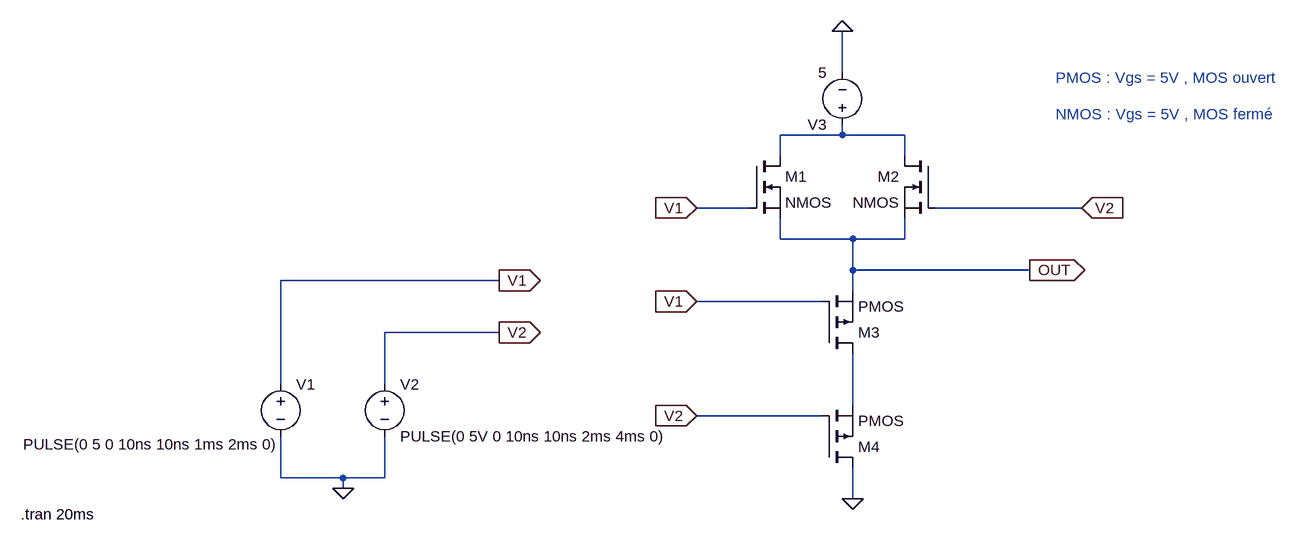
[diagram p0: schematic Draft5.asc]
Draft5.asc, the LTspice schematic file:
Version 4
SHEET 1 940 680
WIRE 256 -384 256 -448
WIRE 256 -288 256 -304
WIRE 256 -288 160 -288
WIRE 352 -288 256 -288
WIRE 160 -256 160 -288
WIRE 352 -256 352 -288
WIRE 112 -176 32 -176
WIRE 624 -176 400 -176
WIRE 160 -128 160 -160
WIRE 272 -128 160 -128
WIRE 352 -128 352 -160
WIRE 352 -128 272 -128
WIRE 272 -80 272 -128
WIRE 544 -80 272 -80
WIRE -272 -64 -608 -64
WIRE 272 -48 272 -80
WIRE 224 -32 32 -32
WIRE -272 16 -448 16
WIRE -608 96 -608 -64
WIRE -448 96 -448 16
WIRE 272 128 272 48
WIRE 224 144 32 144
WIRE -608 240 -608 176
WIRE -512 240 -608 240
WIRE -448 240 -448 176
WIRE -448 240 -512 240
WIRE -512 256 -512 240
WIRE 272 272 272 224
FLAG -272 -64 V1
IOPIN -272 -64 Out
FLAG -272 16 V2
IOPIN -272 16 Out
FLAG 32 -176 V1
IOPIN 32 -176 In
FLAG 624 -176 V2
IOPIN 624 -176 In
FLAG 32 -32 V1
IOPIN 32 -32 In
FLAG 32 144 V2
IOPIN 32 144 In
FLAG 544 -80 OUT
IOPIN 544 -80 Out
FLAG 272 272 0
FLAG 256 -448 0
FLAG -512 256 0
SYMBOL nmos 112 -256 R0
SYMATTR InstName M1
SYMBOL nmos 400 -256 M0
SYMATTR InstName M2
SYMBOL pmos 224 48 M180
SYMATTR InstName M3
SYMBOL pmos 224 224 M180
SYMATTR InstName M4
SYMBOL voltage -608 80 R0
WINDOW 3 -396 108 Left 2
WINDOW 123 0 0 Left 0
WINDOW 39 0 0 Left 0
SYMATTR Value PULSE(0 5 0 10ns 10ns 1ms 2ms 0)
SYMATTR InstName V1
SYMBOL voltage -448 80 R0
WINDOW 123 0 0 Left 0
WINDOW 39 0 0 Left 0
SYMATTR InstName V2
SYMATTR Value PULSE(0 5V 0 10ns 10ns 2ms 4ms 0)
SYMBOL voltage 256 -288 R180
WINDOW 123 0 0 Left 0
WINDOW 39 0 0 Left 0
SYMATTR InstName V3
SYMATTR Value 5
TEXT -1008 296 Left 2 !.tran 20ms
TEXT 584 -376 Left 2 ;PMOS : Vgs = 5V , MOS ouvert
TEXT 584 -320 Left 2 ;NMOS : Vgs = 5V , MOS fermé

The netlist it stands for:
* Draft5.asc
M1 N001 V1 OUT OUT NMOS
M2 N001 V2 OUT OUT NMOS
M3 N002 V1 OUT OUT PMOS
M4 0 V2 N002 N002 PMOS
V1 V1 0 PULSE(0 5 0 10ns 10ns 1ms 2ms 0)
V2 V2 0 PULSE(0 5V 0 10ns 10ns 2ms 4ms 0)
V3 N001 0 5
.model NMOS NMOS
.model PMOS PMOS
.lib standard.mos
.tran 20ms
* PMOS : Vgs = 5V , MOS ouvert
* NMOS : Vgs = 5V , MOS fermé
.backanno
.end

* Results of the author's LTspice run, read from the files saved beside the schematic
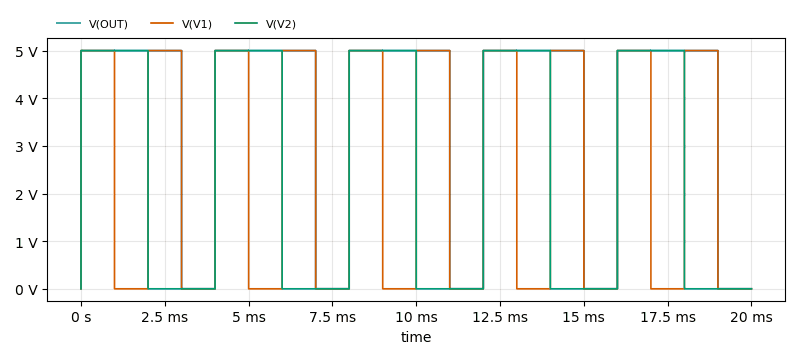
[diagram p1: Transient Analysis of Draft5.asc, plotted from the saved traces]
* Transient Analysis, 1 run:
*   V(OUT): min 2 mV, max 5.005 V, average 3.75 V, rms 4.329 V, last 2 mV
*   V(V1): min 0 V, max 5 V, average 2.5 V, rms 3.536 V, last 0 V
*   V(V2): min 0 V, max 5 V, average 2.5 V, rms 3.536 V, last 0 V